# EAGLE design power (EAGLE 7.5.0)
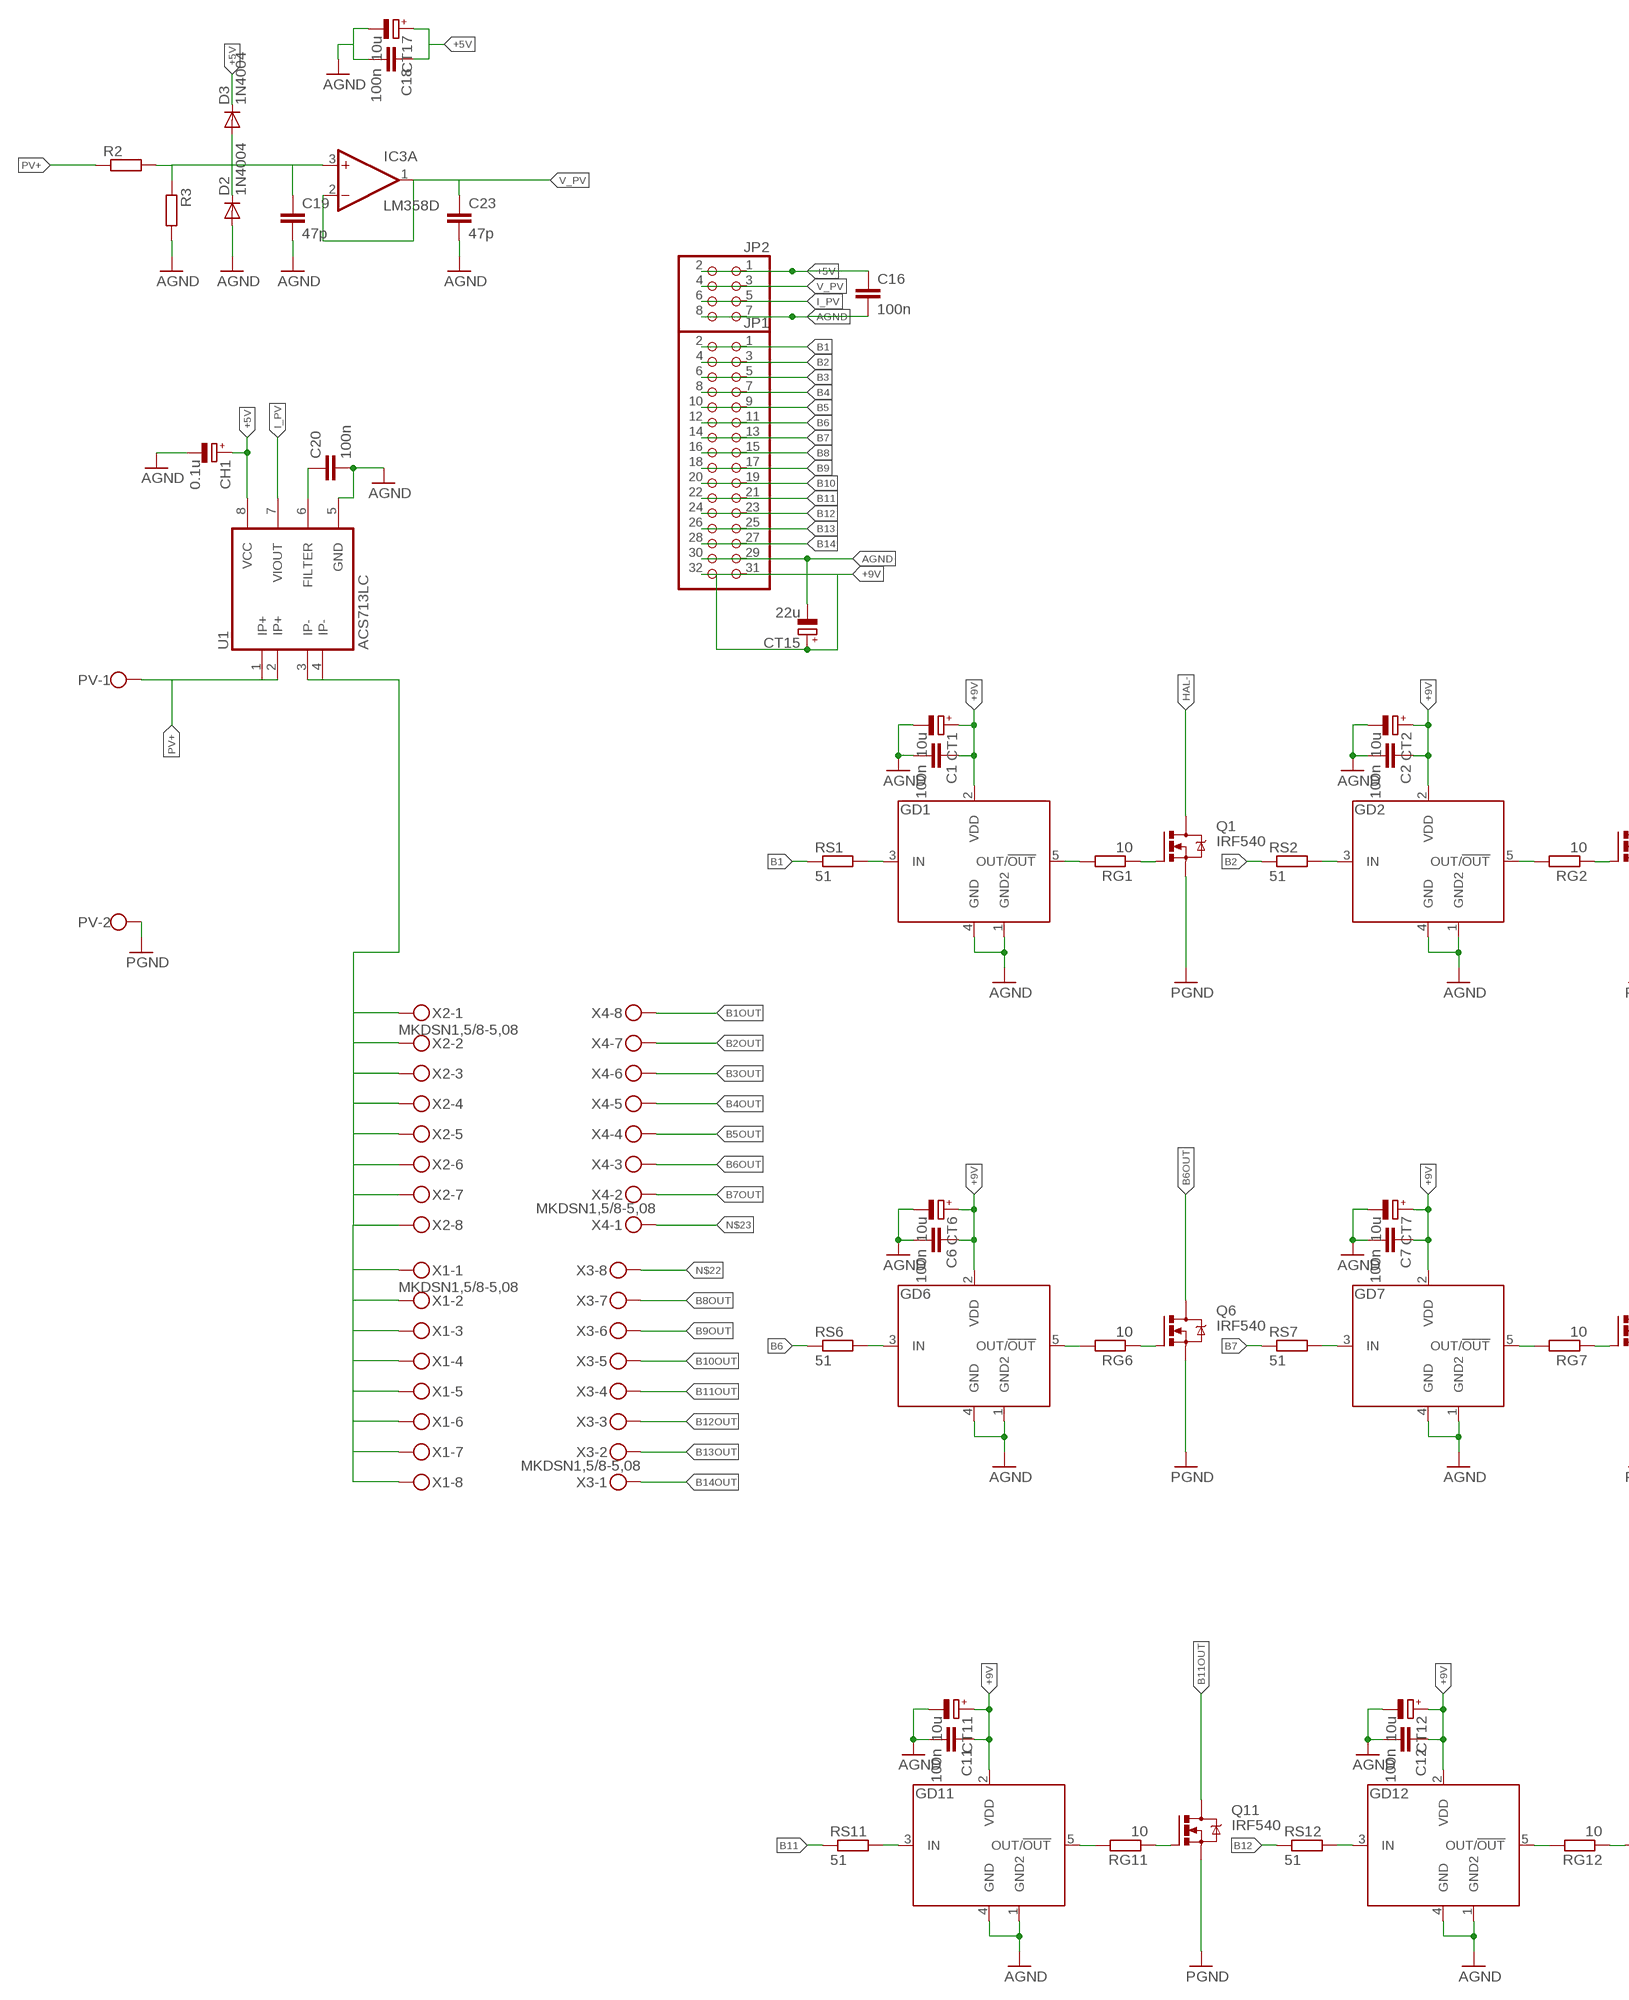
[diagram p0: schematic, sheet 1, part 1 of 2]
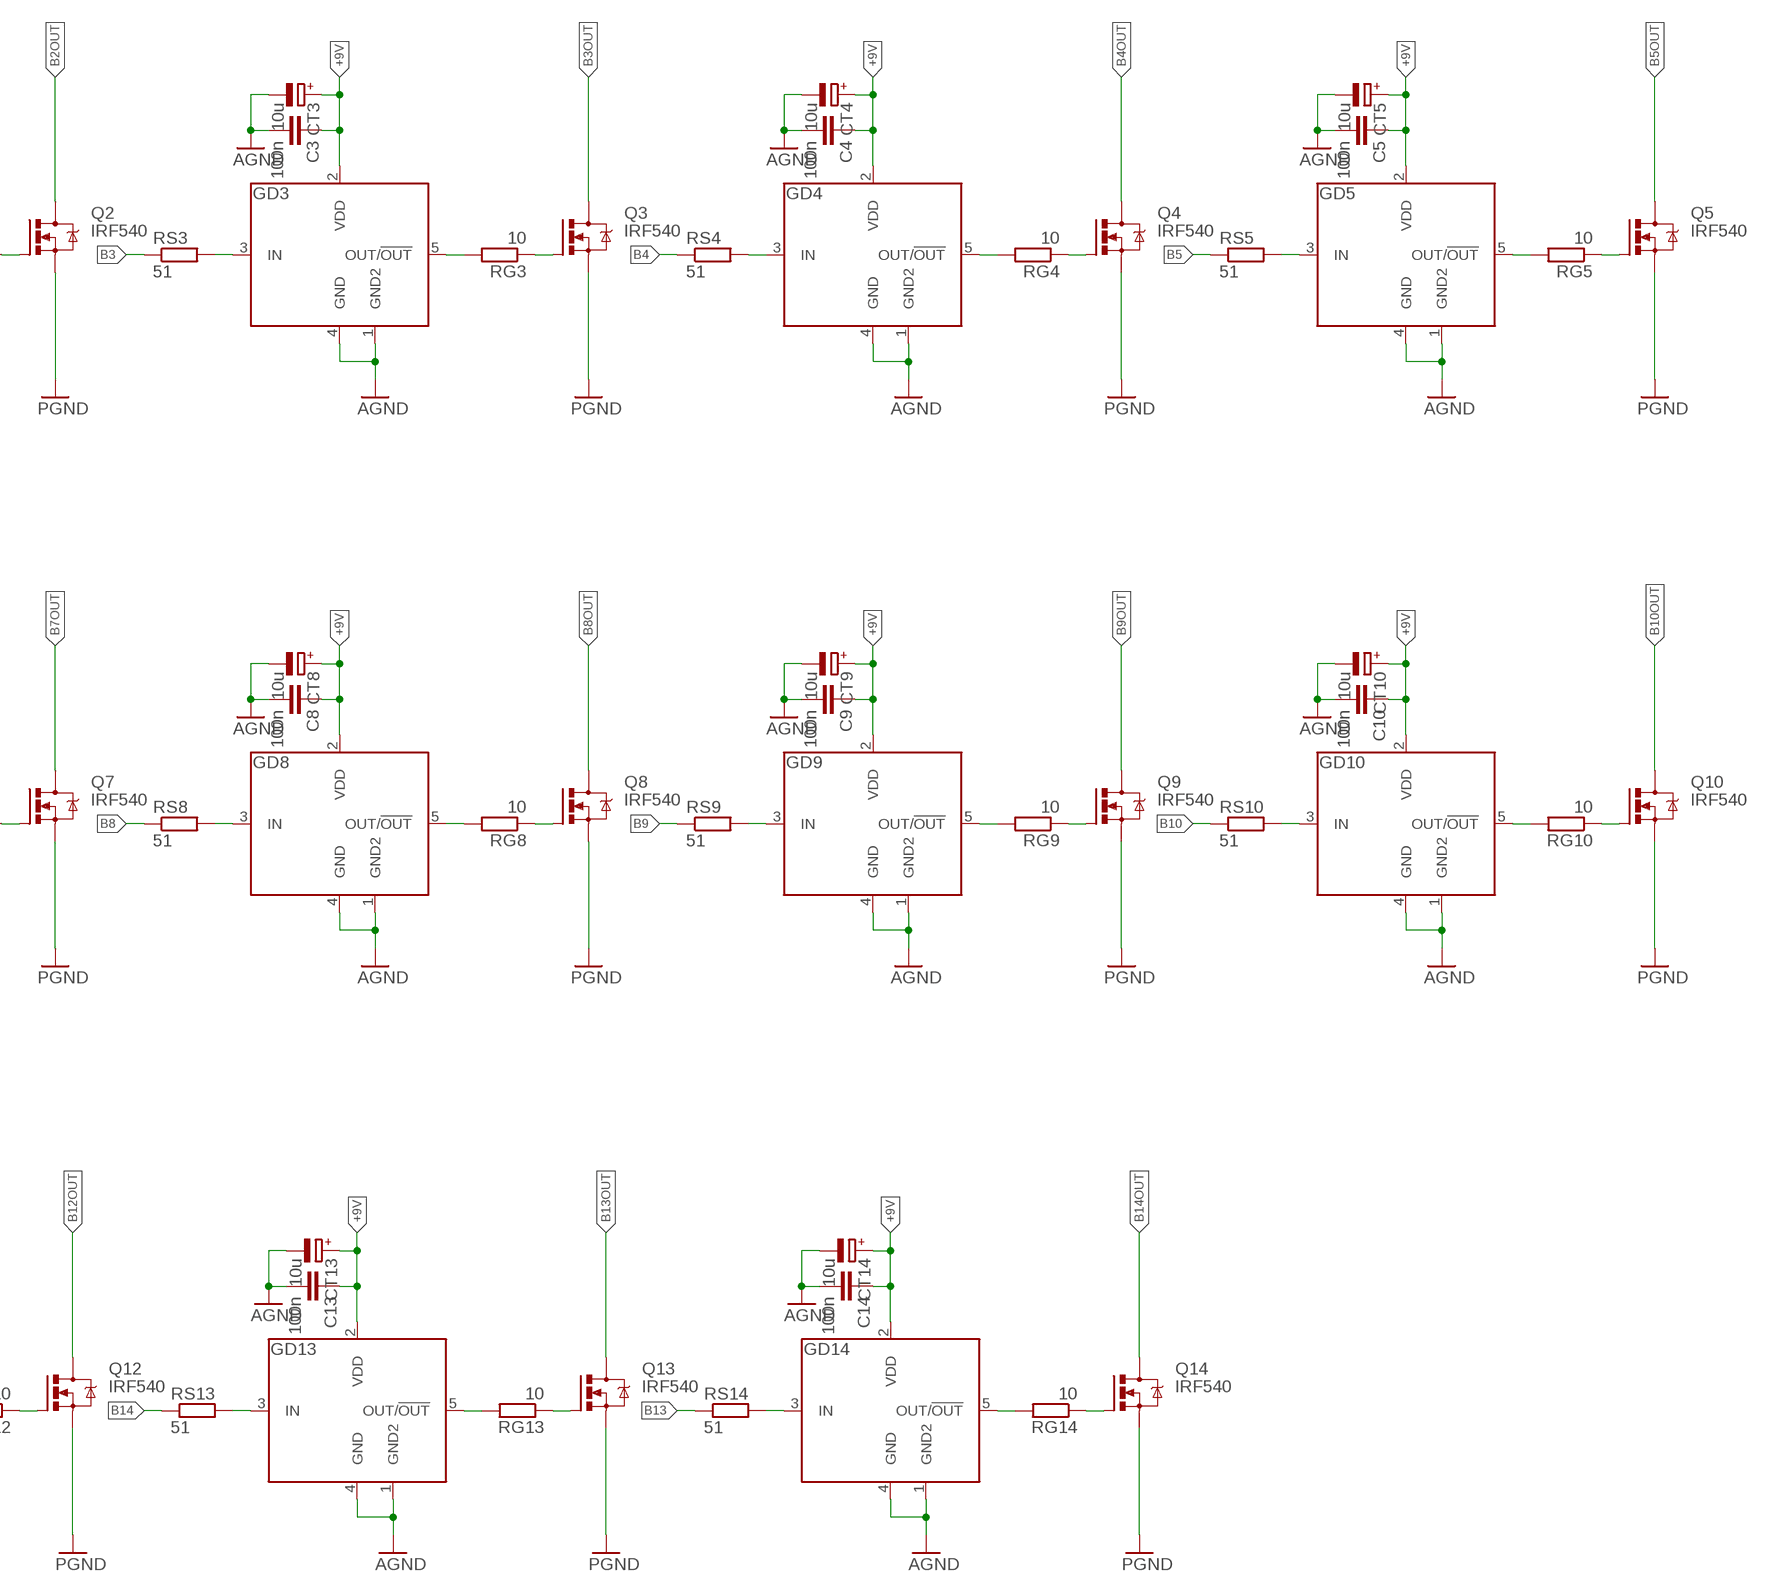
[diagram p1: schematic, sheet 1, part 2 of 2]

## Parts
C1  100n  C-EUC0603  [C0603]
C2  100n  C-EUC0603  [C0603]
C3  100n  C-EUC0603  [C0603]
C4  100n  C-EUC0603  [C0603]
C5  100n  C-EUC0603  [C0603]
C6  100n  C-EUC0603  [C0603]
C7  100n  C-EUC0603  [C0603]
C8  100n  C-EUC0603  [C0603]
C9  100n  C-EUC0603  [C0603]
C10  100n  C-EUC0603  [C0603]
C11  100n  C-EUC0603  [C0603]
C12  100n  C-EUC0603  [C0603]
C13  100n  C-EUC0603  [C0603]
C14  100n  C-EUC0603  [C0603]
C16  100n  C-EUC0603  [C0603]
C18  100n  C-EUC0603  [C0603]
C19  47p  C-EUC0603  [C0603]
C20  100n  C-EUC0603  [C0603]
C23  47p  C-EUC0603  [C0603]
CH1  0.1u  CPOL-EUB/3528-21W  [B/3528-21W]
CT1  10u  CPOL-EUB/3528-21W  [B/3528-21W]
CT2  10u  CPOL-EUB/3528-21W  [B/3528-21W]
CT3  10u  CPOL-EUB/3528-21W  [B/3528-21W]
CT4  10u  CPOL-EUB/3528-21W  [B/3528-21W]
CT5  10u  CPOL-EUB/3528-21W  [B/3528-21W]
CT6  10u  CPOL-EUB/3528-21W  [B/3528-21W]
CT7  10u  CPOL-EUB/3528-21W  [B/3528-21W]
CT8  10u  CPOL-EUB/3528-21W  [B/3528-21W]
CT9  10u  CPOL-EUB/3528-21W  [B/3528-21W]
CT10  10u  CPOL-EUB/3528-21W  [B/3528-21W]
CT11  10u  CPOL-EUB/3528-21W  [B/3528-21W]
CT12  10u  CPOL-EUB/3528-21W  [B/3528-21W]
CT13  10u  CPOL-EUB/3528-21W  [B/3528-21W]
CT14  10u  CPOL-EUB/3528-21W  [B/3528-21W]
CT15  22u  CPOL-EUB/3528-21W  [B/3528-21W]
CT17  10u  CPOL-EUB/3528-21W  [B/3528-21W]
D2  1N4004  [DO214AC]
D3  1N4004  [DO214AC]
GD1  MCP1415/16  [SOT23-5L]
GD2  MCP1415/16  [SOT23-5L]
GD3  MCP1415/16  [SOT23-5L]
GD4  MCP1415/16  [SOT23-5L]
GD5  MCP1415/16  [SOT23-5L]
GD6  MCP1415/16  [SOT23-5L]
GD7  MCP1415/16  [SOT23-5L]
GD8  MCP1415/16  [SOT23-5L]
GD9  MCP1415/16  [SOT23-5L]
GD10  MCP1415/16  [SOT23-5L]
GD11  MCP1415/16  [SOT23-5L]
GD12  MCP1415/16  [SOT23-5L]
GD13  MCP1415/16  [SOT23-5L]
GD14  MCP1415/16  [SOT23-5L]
IC3  LM358D  [SO08]
JP1  PINHD-2X16  [2X16]
JP2  PINHD-2X4  [2X04]
PV  W237-102  [W237-102]
Q1  IRF540  [TO220BV]
Q2  IRF540  [TO220BV]
Q3  IRF540  [TO220BV]
Q4  IRF540  [TO220BV]
Q5  IRF540  [TO220BV]
Q6  IRF540  [TO220BV]
Q7  IRF540  [TO220BV]
Q8  IRF540  [TO220BV]
Q9  IRF540  [TO220BV]
Q10  IRF540  [TO220BV]
Q11  IRF540  [TO220BV]
Q12  IRF540  [TO220BV]
Q13  IRF540  [TO220BV]
Q14  IRF540  [TO220BV]
R2  R-EU_R1206  [R1206]
R3  R-EU_R1206  [R1206]
RG1  10  R-EU_R1206  [R1206]
RG2  10  R-EU_R1206  [R1206]
RG3  10  R-EU_R1206  [R1206]
RG4  10  R-EU_R1206  [R1206]
RG5  10  R-EU_R1206  [R1206]
RG6  10  R-EU_R1206  [R1206]
RG7  10  R-EU_R1206  [R1206]
RG8  10  R-EU_R1206  [R1206]
RG9  10  R-EU_R1206  [R1206]
RG10  10  R-EU_R1206  [R1206]
RG11  10  R-EU_R1206  [R1206]
RG12  10  R-EU_R1206  [R1206]
RG13  10  R-EU_R1206  [R1206]
RG14  10  R-EU_R1206  [R1206]
RS1  51  R-EU_R1206  [R1206]
RS2  51  R-EU_R1206  [R1206]
RS3  51  R-EU_R1206  [R1206]
RS4  51  R-EU_R1206  [R1206]
RS5  51  R-EU_R1206  [R1206]
RS6  51  R-EU_R1206  [R1206]
RS7  51  R-EU_R1206  [R1206]
RS8  51  R-EU_R1206  [R1206]
RS9  51  R-EU_R1206  [R1206]
RS10  51  R-EU_R1206  [R1206]
RS11  51  R-EU_R1206  [R1206]
RS12  51  R-EU_R1206  [R1206]
RS13  51  R-EU_R1206  [R1206]
RS14  51  R-EU_R1206  [R1206]
U1  ACS713LC  [SO08]
X1  MKDSN1,5/8-5,08  [MKDSN1,5/8-5,08]
X2  MKDSN1,5/8-5,08  [MKDSN1,5/8-5,08]
X3  MKDSN1,5/8-5,08  [MKDSN1,5/8-5,08]
X4  MKDSN1,5/8-5,08  [MKDSN1,5/8-5,08]

## Nets
21: GD12.3(IN) RS12.2
4524: GD10.3(IN) RS10.2
24504: GD5.3(IN) RS5.2
27872: GD13.3(IN) RS13.2
85245: GD3.3(IN) RS3.2
125204: GD7.3(IN) RS7.2
152210: GD9.3(IN) RS9.2
245242: GD11.3(IN) RS11.2
254245: GD4.3(IN) RS4.2
+5V: C16.1 C18.1 CH1.+ CT17.+ D3.C JP2.1 JP2.2 U1.8(VCC)
+9V: C1.1 C2.1 C3.1 C4.1 C5.1 C6.1 C7.1 C8.1 C9.1 C10.1 C11.1 C12.1 C13.1 C14.1 CT1.+ CT2.+ CT3.+ CT4.+ CT5.+ CT6.+ CT7.+ CT8.+ CT9.+ CT10.+ CT11.+ CT12.+ CT13.+ CT14.+ CT15.+ GD1.2(VDD) GD2.2(VDD) GD3.2(VDD) GD4.2(VDD) GD5.2(VDD) GD6.2(VDD) GD7.2(VDD) GD8.2(VDD) GD9.2(VDD) GD10.2(VDD) GD11.2(VDD) GD12.2(VDD) GD13.2(VDD) GD14.2(VDD) JP1.31 JP1.32
AGND: C1.2 C2.2 C3.2 C4.2 C5.2 C6.2 C7.2 C8.2 C9.2 C10.2 C11.2 C12.2 C13.2 C14.2 C16.2 C18.2 C19.2 C20.2 C23.2 CH1.- CT1.- CT2.- CT3.- CT4.- CT5.- CT6.- CT7.- CT8.- CT9.- CT10.- CT11.- CT12.- CT13.- CT14.- CT15.- CT17.- D2.A GD1.1(GND2) GD1.4(GND) GD2.1(GND2) GD2.4(GND) GD3.1(GND2) GD3.4(GND) GD4.1(GND2) GD4.4(GND) GD5.1(GND2) GD5.4(GND) GD6.1(GND2) GD6.4(GND) GD7.1(GND2) GD7.4(GND) GD8.1(GND2) GD8.4(GND) GD9.1(GND2) GD9.4(GND) GD10.1(GND2) GD10.4(GND) GD11.1(GND2) GD11.4(GND) GD12.1(GND2) GD12.4(GND) GD13.1(GND2) GD13.4(GND) GD14.1(GND2) GD14.4(GND) JP1.29 JP1.30 JP2.7 JP2.8 R3.2 U1.5(GND)
B1: JP1.1 JP1.2 RS1.1
B1OUT: X4.8
B2: JP1.3 JP1.4 RS2.1
B2OUT: Q2.D X4.7
B3: JP1.5 JP1.6 RS3.1
B3OUT: Q3.D X4.6
B4: JP1.7 JP1.8 RS4.1
B4OUT: Q4.D X4.5
B5: JP1.9 JP1.10 RS5.1
B5OUT: Q5.D X4.4
B6: JP1.11 JP1.12 RS6.1
B6OUT: Q6.D X4.3
B7: JP1.13 JP1.14 RS7.1
B7OUT: Q7.D X4.2
B8: JP1.15 JP1.16 RS8.1
B8OUT: Q8.D X3.7
B9: JP1.17 JP1.18 RS9.1
B9OUT: Q9.D X3.6
B10: JP1.19 JP1.20 RS10.1
B10OUT: Q10.D X3.5
B11: JP1.21 JP1.22 RS11.1
B11OUT: Q11.D X3.4
B12: JP1.23 JP1.24 RS12.1
B12OUT: Q12.D X3.3
B13: JP1.25 JP1.26 RS14.1
B13OUT: Q13.D X3.2
B14: JP1.27 JP1.28 RS13.1
B14OUT: Q14.D X3.1
DVFEWV: GD1.3(IN) RS1.2
HAL-: Q1.D U1.3(IP-) U1.4(IP-) X1.1 X1.2 X1.3 X1.4 X1.5 X1.6 X1.7 X1.8 X2.1 X2.2 X2.3 X2.4 X2.5 X2.6 X2.7 X2.8
I_PV: JP2.5 JP2.6 U1.7(VIOUT)
N$1: GD2.5(OUT/!OUT) RG2.2
N$2: Q1.G RG1.1
N$3: GD1.5(OUT/!OUT) RG1.2
N$4: Q2.G RG2.1
N$5: GD3.5(OUT/!OUT) RG3.2
N$6: Q3.G RG3.1
N$7: GD4.5(OUT/!OUT) RG4.2
N$8: Q4.G RG4.1
N$9: GD5.5(OUT/!OUT) RG5.2
N$10: Q5.G RG5.1
N$11: GD10.5(OUT/!OUT) RG10.2
N$12: Q10.G RG10.1
N$13: GD9.5(OUT/!OUT) RG9.2
N$14: Q9.G RG9.1
N$15: GD8.5(OUT/!OUT) RG8.2
N$16: Q8.G RG8.1
N$17: GD7.5(OUT/!OUT) RG7.2
N$18: Q7.G RG7.1
N$19: GD6.5(OUT/!OUT) RG6.2
N$20: Q6.G RG6.1
N$22: X3.8
N$23: X4.1
N$24: GD11.5(OUT/!OUT) RG11.2
N$25: Q11.G RG11.1
N$26: GD12.5(OUT/!OUT) RG12.2
N$27: Q12.G RG12.1
N$28: GD13.5(OUT/!OUT) RG13.2
N$29: Q13.G RG13.1
N$30: GD14.5(OUT/!OUT) RG14.2
N$31: Q14.G RG14.1
N$33: C19.1 D2.C D3.A IC3.3(A:+IN) R2.2 R3.1
N$34: C20.1 U1.6(FILTER)
N$35: GD2.3(IN) RS2.2
N$45: GD8.3(IN) RS8.2
N$47: GD6.3(IN) RS6.2
N$51: GD14.3(IN) RS14.2
PGND: PV.2 Q1.S Q2.S Q3.S Q4.S Q5.S Q6.S Q7.S Q8.S Q9.S Q10.S Q11.S Q12.S Q13.S Q14.S
PV+: PV.1 R2.1 U1.1(IP+) U1.2(IP+)
V_PV: C23.1 IC3.1(A:OUT) IC3.2(A:-IN) JP2.3 JP2.4
Unconnected: IC3.5(B:+IN) IC3.6(B:-IN) IC3.7(B:OUT)

## Power pins joined to a net without a drawn wire
+5V: IC3.8(P:V+)
AGND: IC3.4(P:V-)

## Library data of the parts
C1-C14 C16 C18-C20 C23 = resistor:C-EU: CAPACITOR, European symbol
CH1 CT1-CT15 CT17 = resistor:CPOL-EU: POLARIZED CAPACITOR, European symbol
D2 D3 = diode:1N4004: DIODE general purpose rectifier, 1 A
GD1-GD14 = microchip2:MCP1415/16: Tiny 1.5A, High-Speed Power MOSFET Driver
IC3 = linear:LM358: OP AMP also LM158; LM258; LM2904 Source: http://cache.national.com/ds/LM/LM158.pdf
JP1 = pinhead:PINHD-2X16: PIN HEADER
JP2 = pinhead:PINHD-2X4: PIN HEADER
PV = con-wago-500:W237-102: WAGO SCREW CLAMP; MPN: 237-102; OC_FARNELL: unknown; OC_NEWARK: 70K9898
Q1-Q14 = transistor-power:IRF540: HEXFET Power MOSFET
R2 R3 RG1-RG14 RS1-RS14 = resistor:R-EU_: RESISTOR, European symbol
U1 = allegro-micro:ACS713: Linear Current Sensor Fully Integrated, Hall Effect-Based 2.1 kVRMS Voltage Isolation and a Low-Resistance Current Conductor
X1-X4 = con-phoenix-508:MKDSN1,5/8-5,08: MKDSN 1,5/ 8-5,08 Printklemme Nennstrom: 13,5 A Nennspannung: 250 V Rastermaß: 5,08 mm Polzahl: 8 Anschlussart: Schraubanschluss Montage: Löten Anschlussrichtung Leiter/Platine: 0 ° Artikelnummer: 1729186 Source: http://eshop.phoenixcontact.com .. 1729186.pdf

## Board
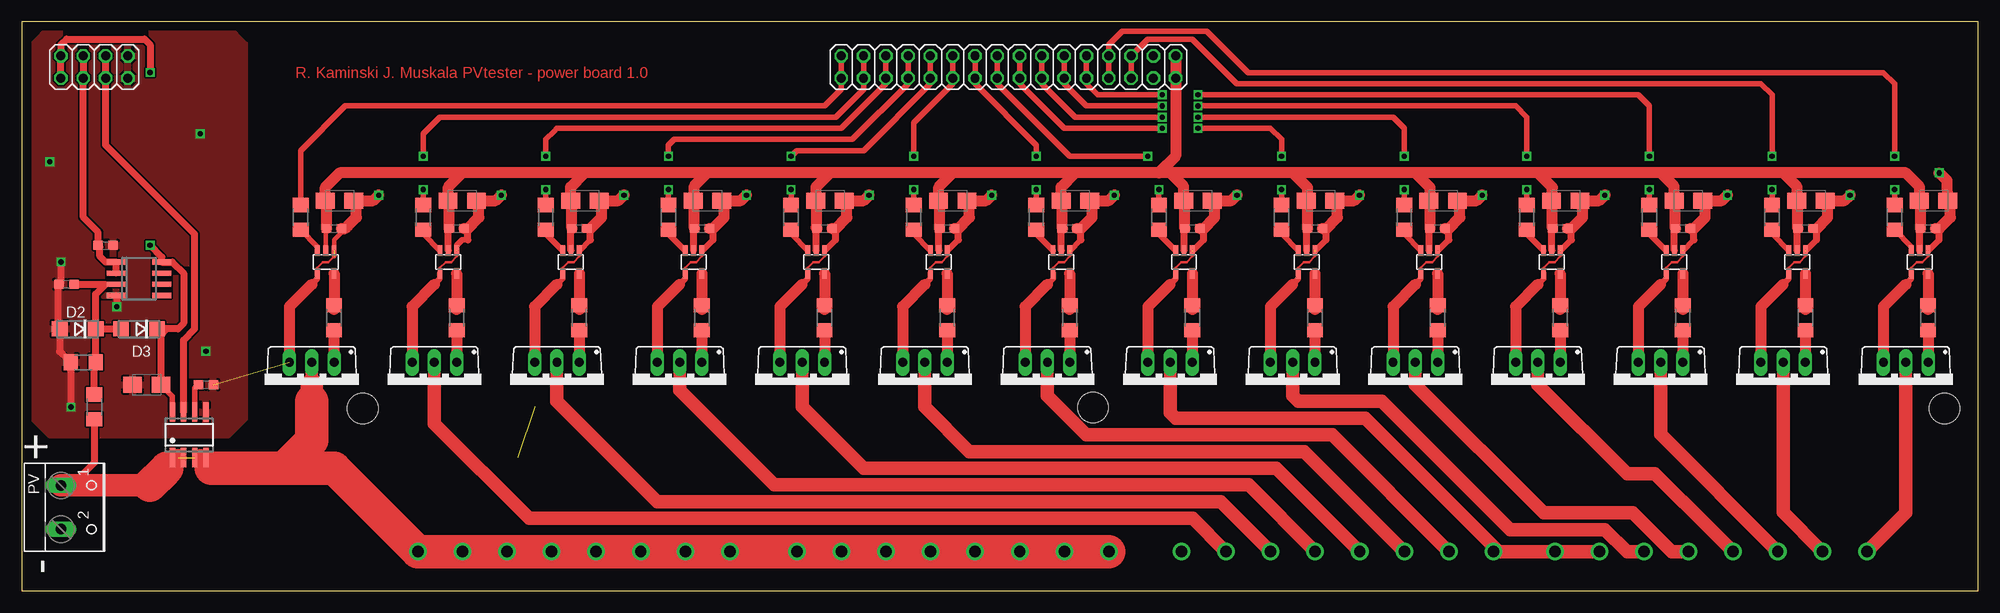
[diagram p2: board, top side]
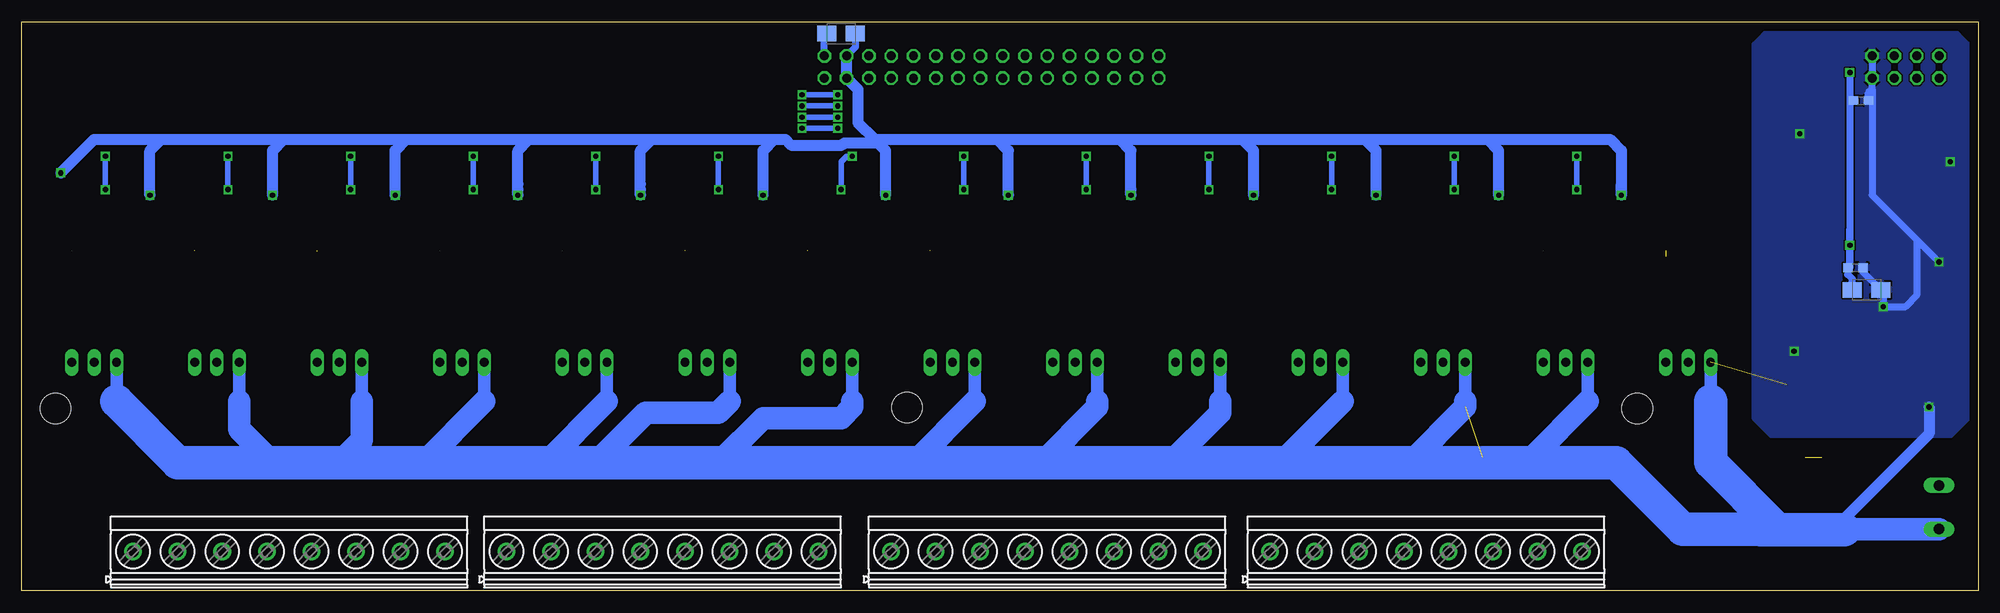
[diagram p3: board, bottom side, seen from below]

Size 222.87 x 64.82 mm. Coordinates in mm from the lower left corner, seen from the top.
Outline: 0,0 222.87,0 222.87,64.82 0,64.82 0,0
Copper layers (1*16): Top 0.035mm / dielectric 1.5mm / Bottom 0.035mm
Design rules "default *": minimum track width 8mil, minimum drill 0.3mm, track to track 8mil, track to pad 8mil, pad to pad 8mil, via to via 8mil, smd to smd 8mil, copper to edge 40mil, drill to drill 8mil, minimum pad ring 10mil, minimum via ring 8mil, stop-mask expansion 4mil, vias tented up to drill 0mil, thermal gap 10mil
Holes 3.5 mm at 219.03,20.8 122.02,20.92 38.83,20.8

### Footprints (pad centres in the part's own frame; a part is rotated, then mirrored left to right if it is on the bottom)
C0603 = smd 1.1 x 1: 1 -0.85,0; 2 0.85,0
B/3528-21W = smd 2.15 x 1.8: + 1.625,0; - -1.625,0
DO214AC = smd 1.8 x 1.7: A 2.05,0; C -2.05,0
SOT23-5L = smd 0.55 x 1.2: 1 -0.95,-1.3; 2 0,-1.3; 3 0.95,-1.3; 4 0.95,1.3; 5 -0.95,1.3
SO08 = smd 0.6 x 2.2: 1 -1.905,-2.6; 2 -0.635,-2.6; 3 0.635,-2.6; 4 1.905,-2.6; 5 1.905,2.6; 6 0.635,2.6; 7 -0.635,2.6; 8 -1.905,2.6
2X16 = drill 1.016 octagon: 1 -19.05,-1.27; 2 -19.05,1.27; 3 -16.51,-1.27; 4 -16.51,1.27; 5 -13.97,-1.27; 6 -13.97,1.27; 7 -11.43,-1.27; 8 -11.43,1.27; 9 -8.89,-1.27; 10 -8.89,1.27; 11 -6.35,-1.27; 12 -6.35,1.27; 13 -3.81,-1.27; 14 -3.81,1.27; 15 -1.27,-1.27; 16 -1.27,1.27; 17 1.27,-1.27; 18 1.27,1.27; 19 3.81,-1.27; 20 3.81,1.27; 21 6.35,-1.27; 22 6.35,1.27; 23 8.89,-1.27; 24 8.89,1.27; 25 11.43,-1.27; 26 11.43,1.27; 27 13.97,-1.27; 28 13.97,1.27; 29 16.51,-1.27; 30 16.51,1.27; 31 19.05,-1.27; 32 19.05,1.27
2X04 = drill 1.016 octagon: 1 -3.81,-1.27; 2 -3.81,1.27; 3 -1.27,-1.27; 4 -1.27,1.27; 5 1.27,-1.27; 6 1.27,1.27; 7 3.81,-1.27; 8 3.81,1.27
W237-102 = drill 1.194 long: 1 -2.5,-1.27; 2 2.5,-1.27
TO220BV = drill 1.016 long: D 0,-2.54; G -2.54,-2.54; S 2.54,-2.54
R1206 = smd 1.6 x 1.803: 1 -1.422,0; 2 1.422,0
MKDSN1,5/8-5,08 = drill 1.3 pad 2: 1 -17.801,0.025; 2 -12.721,0.025; 3 -7.641,0.025; 4 -2.561,0.025; 5 2.519,0.025; 6 7.599,0.025; 7 12.679,0.025; 8 17.759,0.025

### Placement (x,y rotation side)
C1  35.56,41.27 0 top
C2  49.53,41.27 0 top
C3  63.5,41.29 0 top
C4  77.47,41.29 0 top
C5  91.44,41.27 0 top
C6  105.41,41.27 0 top
C7  119.38,41.27 0 top
C8  133.35,41.27 0 top
C9  147.32,41.27 0 top
C10  161.28,41.27 0 top
C11  175.26,41.27 0 top
C12  189.23,41.27 0 top
C13  203.2,41.27 0 top
C14  217.17,41.29 0 top
C16  13.34,55.88 0 bottom
C18  13.97,36.83 0 bottom
C19  5.08,34.92 180 top
C20  20.96,23.5 0 top
C23  9.52,39.37 0 top
CH1  14.22,23.5 0 top
CT1  36.19,44.45 180 top
CT2  50.16,44.45 180 top
CT3  64.13,44.45 180 top
CT4  78.1,44.45 180 top
CT5  92.08,44.45 180 top
CT6  106.05,44.45 180 top
CT7  120.02,44.45 180 top
CT8  133.99,44.45 180 top
CT9  147.96,44.45 180 top
CT10  161.93,44.45 180 top
CT11  175.9,44.45 180 top
CT12  189.87,44.45 180 top
CT13  203.84,44.45 180 top
CT14  217.81,44.45 180 top
CT15  129.54,63.5 180 bottom
CT17  12.7,34.29 180 bottom
D2  6.35,29.85 180 top
D3  13.34,29.85 180 top
GD1  34.61,37.46 180 top
GD2  48.58,37.46 180 top
GD3  62.55,37.46 180 top
GD4  76.52,37.46 180 top
GD5  90.49,37.46 180 top
GD6  104.46,37.46 180 top
GD7  118.43,37.46 180 top
GD8  132.4,37.46 180 top
GD9  146.37,37.46 180 top
GD10  160.34,37.46 180 top
GD11  174.31,37.46 180 top
GD12  188.28,37.46 180 top
GD13  202.25,37.46 180 top
GD14  216.22,37.48 180 top
IC3  13.34,35.56 270 top
JP1  112.39,59.69 0 top
JP2  8.25,59.69 0 top
PV  5.71,9.53 270 top
Q1  33.02,23.5 180 top
Q2  46.99,23.5 180 top
Q3  60.96,23.5 180 top
Q4  74.93,23.5 180 top
Q5  88.9,23.5 180 top
Q6  102.87,23.5 180 top
Q7  116.84,23.5 180 top
Q8  130.81,23.5 180 top
Q9  144.78,23.5 180 top
Q10  158.75,23.5 180 top
Q11  172.72,23.5 180 top
Q12  186.69,23.5 180 top
Q13  200.66,23.5 180 top
Q14  214.63,23.5 180 top
R2  8.25,20.96 90 top
R3  6.98,26.04 180 top
RG1  35.56,31.11 90 top
RG2  49.53,31.11 90 top
RG3  63.5,31.11 90 top
RG4  77.47,31.11 90 top
RG5  91.44,31.11 90 top
RG6  105.41,31.11 90 top
RG7  119.38,31.11 90 top
RG8  133.35,31.11 90 top
RG9  147.32,31.11 90 top
RG10  161.29,31.11 90 top
RG11  175.26,31.11 90 top
RG12  189.23,31.11 90 top
RG13  203.2,31.11 90 top
RG14  217.17,31.11 90 top
RS1  31.75,42.54 270 top
RS2  45.72,42.54 270 top
RS3  59.69,42.54 270 top
RS4  73.66,42.54 270 top
RS5  87.63,42.54 270 top
RS6  101.6,42.54 270 top
RS7  115.57,42.54 270 top
RS8  129.54,42.54 270 top
RS9  143.51,42.54 270 top
RS10  157.48,42.54 270 top
RS11  171.45,42.54 270 top
RS12  185.42,42.54 270 top
RS13  199.39,42.54 270 top
RS14  213.36,42.54 270 top
U1  19.05,17.78 0 top
X1  106.05,4.45 0 bottom
X2  62.86,4.45 0 bottom
X3  192.41,4.45 0 bottom
X4  149.86,4.45 0 bottom

### Tracks (layer width: path | path; a pad name or v marks a point on that pad's centre or on a via)
21
  Top 0.61: RS12.2 185.42,40.67 GD12.3
4524
  Top 0.61: RS10.2 157.48,40.67 GD10.3
24504
  Top 0.61: RS5.2 87.63,40.67 GD5.3
27872
  Top 0.305: GD13.3 201.3,38.74 201.3,38.73
  Top 0.61: RS13.2 199.39,40.67 GD13.3
85245
  Top 0.61: RS3.2 59.69,40.67 GD3.3
125204
  Top 0.61: RS7.2 115.57,40.67 GD7.3
152210
  Top 0.305: GD9.3 145.39,38.77
  Top 0.61: RS9.2 143.51,40.67 GD9.3
245242
  Top 0.61: RS11.2 171.45,40.67 GD11.3
254245
  Top 0.61: RS4.2 73.66,40.67 GD4.3
+5V  (via drill 0.6)
  Top 0.61: U1.8 17.14,22.2 CH1.+
  Top 0.813: JP2.1 JP2.2 4.45,62.23 5.08,62.86 13.97,62.86 14.61,62.23 v14.61,59.05 | 16.51,29.85 17.78,29.85 18.42,30.48 18.42,36.2 17.14,37.46 IC3.8 | 16.51,29.85 D3.C 15.24,29.85 | IC3.8 15.93,38.04 v14.61,39.37 | IC3.8 15.88,37.46 | CH1.+ 15.85,29.18 16.51,29.85
  Bottom 0.813: 14.82,34.78 CT17.+ 14.32,35.53 14.86,36.07 14.86,36.79 C18.1 | v14.61,59.05 14.61,55.88 | 14.61,55.88 v14.61,39.37 | v14.61,39.37 14.61,37.04 C18.1 | v14.61,39.37 14.61,41.27 | C18.1 14.61,36.83 v14.61,39.37 | C16.1 14.61,55.88
+9V
  Top 0.508: GD1.2 34.61,41.27
  Top 0.61: GD1.2
  Top 0.813: 34.61,41.27 C1.1 34.61,41.27 | 174.37,41.34 C11.1 174.31,41.27 GD11.2 | GD2.2 48.58,41.27 C2.1 | GD3.2 62.55,41.28 C3.1 | GD4.2 76.52,41.28 C4.1 | GD5.2 90.49,41.27 C5.1 | GD6.2 104.46,41.27 C6.1 | GD7.2 118.43,41.27 C7.1 | GD8.2 132.4,41.27 C8.1 | GD9.2 146.37,41.27 C9.1 | GD10.2 160.34,41.27 C10.1 | GD12.2 188.28,41.27 C12.1 | GD13.2 202.25,41.27 C13.1 | GD14.2 216.22,41.28 C14.1
  Top 1.27: 34.61,44.39 CT1.+ | 62.55,44.39 CT3.+ | 76.52,44.39 CT4.+ 76.62,44.31 | 90.49,44.39 CT5.+ | 118.43,44.39 CT7.+ | 132.4,44.39 CT8.+ | 146.37,44.39 CT9.+ 146.47,44.31 | 160.33,44.38 CT10.+ 160.43,44.32 | 188.28,44.39 CT12.+ | CT14.+ 216.22,44.39 216.22,45.09 | 129.54,47.62 131.45,49.53 JP1.31 JP1.32 | 129.54,47.62 120.02,47.62 | 120.02,47.62 106.05,47.62 | 106.05,47.62 92.08,47.62 | 92.08,47.62 78.1,47.62 | 78.1,47.62 64.13,47.62 | 64.13,47.62 50.16,47.62 | 50.16,47.62 36.19,47.62 34.57,46 CT1.+ | 50.16,47.62 48.58,46.04 48.58,44.39 CT2.+ 48.68,44.31 C2.1 | 90.49,44.39 90.49,46.04 92.08,47.62 | 106.05,47.62 104.46,46.04 104.46,44.39 CT6.+ 104.56,44.31 C6.1 | 200.66,47.62 214.63,47.62 216.22,46.03 216.22,45.09 | 200.66,47.62 186.69,47.62 | 186.69,47.62 172.72,47.62 | 172.72,47.62 158.75,47.62 | 158.75,47.62 144.78,47.62 | 144.78,47.62 130.81,47.62 | 130.81,47.62 129.54,47.62 | C14.1 216.32,44.98 216.22,45.09 | C13.1 202.35,44.31 CT13.+ 202.25,44.39 202.25,46.03 200.66,47.62 | C12.1 188.38,44.31 CT12.+ | 174.37,41.34 174.37,44.35 | 174.37,44.35 CT11.+ | C1.1 34.71,44.31 CT1.+ | CT12.+ 188.24,46.07 186.69,47.62 | 174.37,44.35 174.37,45.97 172.72,47.62 | C10.1 160.43,44.32 | 160.43,44.32 160.43,45.95 158.75,47.62 | C9.1 146.47,44.31 | 146.47,44.31 146.47,45.93 144.78,47.62 | C8.1 132.5,44.31 CT8.+ | CT8.+ 132.36,46.07 130.81,47.62 | CT7.+ 118.39,46 120.02,47.62 | C7.1 118.53,44.31 CT7.+ | 90.49,44.39 90.49,41.38 C5.1 | C4.1 76.62,44.31 | 76.62,44.31 76.62,46.14 78.1,47.62 | C3.1 62.65,44.31 CT3.+ | CT3.+ 62.51,46 64.13,47.62
  Bottom 0.813: 131.03,63.28 130.81,63.5 CT15.+ 131.45,63.22 JP1.32
AGND  (via drill 0.6)  (11 unrouted)
  Top 0.305: GD1.4 33.66,36.83 34.29,37.46 34.92,37.46 35.56,38.1 | GD2.4 47.63,36.83 48.26,37.46 48.89,37.46 49.53,38.1 GD2.1 | GD3.4 61.6,36.83 62.23,37.46 62.86,37.46 63.5,38.1 GD3.1 | GD4.4 75.57,36.83 76.2,37.46 76.83,37.46 77.47,38.1 GD4.1 | GD5.4 89.54,36.83 90.17,37.46 90.8,37.46 91.44,38.1 GD5.1 | GD6.4 103.51,36.83 104.14,37.46 104.77,37.46 105.41,38.1 GD6.1 | GD7.4 117.48,36.83 118.11,37.46 118.74,37.46 119.38,38.1 GD7.1 | GD8.4 131.45,36.83 132.08,37.46 132.72,37.46 133.35,38.1 GD8.1 | GD9.4 145.42,36.83 146.05,37.46 146.69,37.46 147.32,38.1 GD9.1 | GD10.4 159.39,36.83 160.02,37.46 160.66,37.46 161.29,38.1 GD10.1 | GD11.4 173.36,36.83 173.99,37.46 174.62,37.46 175.26,38.1 GD11.1 | GD12.4 187.33,36.83 187.96,37.46 188.59,37.46 189.23,38.1 GD12.1 | GD13.4 201.3,36.83 201.93,37.46 202.56,37.46 203.2,38.1 GD13.1 | GD14.4 215.27,36.83 215.9,37.46 216.53,37.46 217.17,38.1 GD14.1
  Top 0.508: 35.56,38.1 35.56,40 37.15,41.59
  Top 0.61: 50.8,40 50.16,40 49.53,39.37 GD2.1 | 217.21,38.78 218.44,40 | 203.23,38.77 204.47,40 | 189.26,38.77 190.5,40 | 175.29,38.77 176.53,40 | 161.32,38.77 162.56,40 | 147.35,38.77 148.59,40 | 133.38,38.77 134.62,40 | 119.41,38.77 120.65,40 | GD6.1 105.44,38.77 106.68,40 | GD5.1 91.47,38.77 92.71,40 | GD4.1 77.5,38.77 78.74,40 | GD3.1 63.53,38.77 64.77,40 | GD14.4 215.27,35.56 214.63,34.92 | GD13.4 201.3,35.56 200.66,34.92 | GD12.4 187.33,35.56 186.69,34.92 | GD11.4 173.36,35.56 172.72,34.92 | GD10.4 159.39,35.56 158.75,34.92 | GD9.4 145.42,35.56 144.78,34.92 | GD8.4 131.45,35.56 130.81,34.92 | GD7.4 117.48,35.56 116.84,34.92 | GD6.4 103.51,35.56 102.87,34.92 | GD5.4 89.54,35.56 88.9,34.92 | GD4.4 75.57,35.56 74.93,34.92 | GD3.4 61.6,35.56 60.96,34.92 | GD2.4 47.63,35.56 46.99,34.92 | GD1.4 33.66,35.56 33.02,34.92
  Top 0.813: 4.45,35.24 C19.2 | 92.71,40 92.71,40.95 C5.2 | 78.74,40 78.74,40.97 C4.2 | 64.77,40 64.77,41.27 64.46,41.27 C3.2 | 50.8,40 50.8,40.95 C2.2 | 106.68,40 106.68,40.95 C6.2 | 120.65,40 120.65,40.95 C7.2 | 134.62,40 134.62,40.95 C8.2 | 148.59,40 148.59,40.95 C9.2 | 162.56,40 162.56,40.94 C10.2 | 176.53,40 176.53,40.95 C11.2 | 190.5,40 190.5,40.95 C12.2 | 204.47,40 204.47,41.27 C13.2 | 218.44,40 218.44,40.97 C14.2 | C19.2 4.13,34.82 4.13,30.02 D2.A 4.3,27.3 R3.2 5.56,20.98 v5.59,20.96 | v4.45,37.46 4.45,35.14 C19.2 | IC3.4 10.73,33.59 10.79,33.59 v10.79,32.38
  Top 1.27: v124.46,45.09 123.83,44.45 CT7.- 121.92,44.17 121.92,42.54 120.65,41.27 C7.2 | v110.49,45.09 109.85,44.45 CT6.- 107.95,44.17 107.95,42.54 106.68,41.27 C6.2 | v96.52,45.09 95.88,44.45 CT5.- 93.98,44.17 93.98,42.54 92.71,41.27 C5.2 | v82.55,45.09 81.91,44.45 CT4.- 80.01,44.17 80.01,42.54 78.75,41.29 C4.2 | v68.58,45.09 67.94,44.45 CT3.- 66.04,44.17 66.04,42.54 64.77,41.27 | v54.61,45.09 53.97,44.45 CT2.- 52.07,44.17 52.07,42.54 50.8,41.27 C2.2 | v40.64,45.09 40,44.45 CT1.- 38.1,44.17 38.1,42.54 37.15,41.59 36.83,41.27 C1.2 | v138.43,45.09 137.8,44.45 CT8.- 135.89,44.17 135.89,42.54 134.62,41.27 C8.2 | v152.4,45.09 151.77,44.45 CT9.- 149.86,44.17 149.86,42.54 148.59,41.27 C9.2 | v166.37,45.09 165.74,44.45 CT10.- 163.83,44.17 163.83,42.54 162.56,41.27 C10.2 | v180.34,45.09 179.71,44.45 CT11.- 177.8,44.17 177.8,42.54 176.53,41.27 C11.2 | v194.31,45.09 193.68,44.45 CT12.- 191.77,44.17 191.77,42.54 190.5,41.27 C12.2 | v208.28,45.09 207.65,44.45 CT13.- 205.74,44.17 205.74,42.54 204.47,41.27 | v218.44,47.62 219.33,46.74 CT14.- 219.71,44.17 219.71,42.54 218.45,41.29 C14.2 | 214.63,34.92 212.09,32.38 212.09,26.04 | 200.66,34.92 198.12,32.38 198.12,26.04 | 186.69,34.92 184.15,32.38 184.15,26.04 | 172.72,34.92 170.18,32.38 170.18,26.04 | 158.75,34.92 156.21,32.38 156.21,26.04 | 144.78,34.92 142.24,32.38 142.24,26.04 | 130.81,34.92 128.27,32.38 128.27,26.04 | 116.84,34.92 114.3,32.38 114.3,26.04 | 102.87,34.92 100.33,32.38 100.33,26.04 | 88.9,34.92 86.36,32.38 86.36,26.04 | 74.93,34.92 72.39,32.38 72.39,26.04 | 60.96,34.92 58.42,32.38 58.42,26.04 | 46.99,34.92 44.45,32.38 44.45,26.04
  Top 1.27: 33.02,34.92 30.48,32.38 30.48,26.04
  Bottom 0.813: C18.2 13.12,36.34 CT17.- 11.07,33.93 10.79,33.93 v10.79,32.38 8.25,32.38 6.98,33.66 6.98,40 | v4.45,37.46 6.98,40 | JP2.8 JP2.7 12.07,57.15 | 12.07,57.15 12.07,45.09 6.98,40 | CT15.- 127.92,61.95 JP1.30 | C16.2 12.48,56.73 12.07,57.15
  Bottom 1.27: 96.52,45.72 v96.52,45.09 96.52,50.16 97.79,51.43 | 82.55,45.72 v82.55,45.09 82.55,50.16 83.82,51.43 | v138.43,45.09 138.43,45.72 | v152.4,45.09 152.4,45.72 | v166.37,45.09 166.37,45.72 | v180.34,45.09 180.34,45.72 | JP1.30 JP1.29 127.64,57.15 127.64,53.34 125.73,51.43 | 40.64,46.35 v40.64,45.09 40.64,50.16 41.91,51.43 55.88,51.43 | v138.43,45.09 138.43,46.35 | v152.4,45.09 152.4,46.35 | v166.37,45.09 166.37,46.35 | v180.34,45.09 180.34,46.35 | 194.31,46.35 v194.31,45.09 194.31,50.16 193.04,51.43 | 125.73,51.43 125.09,51.43 | 125.09,51.43 111.76,51.43 | 111.76,51.43 97.79,51.43 | 97.79,51.43 83.82,51.43 | 83.82,51.43 69.85,51.43 | 69.85,51.43 55.88,51.43 | v54.61,45.09 54.61,50.16 55.88,51.43 | v68.58,45.09 68.58,50.16 69.85,51.43 | v110.49,45.09 110.49,50.16 111.76,51.43 | v124.46,45.09 124.46,50.16 125.73,51.43 | v138.43,45.09 138.43,50.16 137.16,51.43 | v152.4,45.09 152.4,50.16 151.13,51.43 | 151.13,51.43 137.16,51.43 | v166.37,45.09 166.37,50.16 165.1,51.43 | 165.1,51.43 151.13,51.43 | v180.34,45.09 180.34,50.16 179.07,51.43 | 179.07,51.43 165.1,51.43 | 193.04,51.43 179.07,51.43 | v208.28,45.09 208.28,50.16 207.01,51.43 | 207.01,51.43 193.04,51.43 | v218.44,47.62 214.63,51.43 207.01,51.43 | 137.16,51.43 135.89,51.43 135.26,50.8 129.41,50.8 129.16,51.05 125.48,51.05 125.09,51.43 | v5.59,20.96 5.59,17.91 16.51,6.98
  other vias: 3.18,48.89 20.32,52.07 20.96,27.3
  pour Bottom: 1.27,62.23 1.27,19.69 3.18,17.78 23.5,17.78 25.4,19.69 25.4,62.23 23.5,64.13 3.18,64.13
  pour Top: 1.27,62.23 1.27,19.69 3.18,17.78 23.5,17.78 25.4,19.69 25.4,62.23 23.5,64.13 3.18,64.13
B1
  Top 0.61: JP1.2 JP1.1 93.34,57.15 91.44,55.24 36.83,55.24 31.75,50.16 RS1.1
B2  (via drill 0.6)
  Top 0.61: v45.72,49.53 45.72,52.07 47.62,53.97 92.71,53.97 95.88,57.15 JP1.3 JP1.4 | RS2.1 v45.72,45.72
  Bottom 0.61: v45.72,45.72 v45.72,49.53
B2OUT
  Top 1.422: Q2.D 46.99,23.5
  Top 1.524: 46.99,23.5 46.99,19.05 57.78,8.25 133.4,8.25 X4.7
B3  (via drill 0.6)
  Top 0.61: v59.69,49.53 59.69,51.43 60.64,52.39 60.96,52.7 93.34,52.7 98.42,57.78 JP1.5 JP1.6 | RS3.1 v59.69,45.72
  Bottom 0.61: v59.69,49.53 v59.69,45.72
B3OUT
  Top 1.422: Q3.D 60.96,23.5
  Top 1.524: 60.96,23.5 60.96,21.59 72.39,10.16 136.57,10.16 X4.6
B4  (via drill 0.6)
  Top 0.61: v73.66,49.53 73.66,50.8 74.3,51.43 94.61,51.43 100.96,57.78 JP1.7 JP1.8 | RS4.1 v73.66,45.72
  Bottom 0.61: v73.66,49.53 v73.66,45.72
B4OUT
  Top 1.422: Q4.D 74.93,23.5
  Top 1.524: 74.93,23.5 74.93,22.86 85.72,12.06 139.75,12.06 X4.5
B5  (via drill 0.6)
  Top 0.61: JP1.10 JP1.9 103.5,57.78 95.88,50.16 88.27,50.16 v87.63,49.53 | RS5.1 v87.63,45.72
  Bottom 0.61: v87.63,49.53 v87.63,45.72
B5OUT
  Top 1.422: Q5.D 88.9,23.5
  Top 1.524: 88.9,23.5 88.9,20.96 95.88,13.97 142.92,13.97 X4.4
B6  (via drill 0.6)
  Top 0.61: v101.6,49.53 101.6,53.34 106.05,57.78 JP1.11 JP1.12 | RS6.1 v101.6,45.72
  Bottom 0.61: v101.6,49.53 v101.6,45.72
B6OUT
  Top 1.422: Q6.D 102.87,23.5
  Top 1.524: 102.87,23.5 102.87,20.96 107.95,15.87 146.1,15.87 X4.3
B7  (via drill 0.6)
  Top 0.61: v115.57,49.53 115.57,50.8 108.58,57.78 JP1.13 JP1.14 | RS7.1 v115.57,45.72
  Bottom 0.61: v115.57,49.53 v115.57,45.72
B7OUT
  Top 1.422: Q7.D 116.84,23.5
  Top 1.524: 116.84,23.5 116.84,22.23 121.28,17.78 149.27,17.78 X4.2
B8  (via drill 0.6)
  Top 0.61: v128.27,49.53 119.38,49.53 111.12,57.78 JP1.15 JP1.16 | RS8.1 v129.54,45.72
  Bottom 0.61: v129.54,45.72 129.54,48.89 128.91,49.53 v128.27,49.53
B8OUT
  Top 1.422: Q8.D 130.81,23.5
  Top 1.524: 130.81,23.5 130.81,20.32 131.45,19.69 153.03,19.69 168.28,4.45 179.7,4.45 X3.7
B9  (via drill 0.6)
  Top 0.61: v129.92,52.7 118.74,52.7 113.67,57.78 JP1.17 JP1.18 | v143.51,49.53 143.51,51.43 142.24,52.7 v133.99,52.7 | RS9.1 v143.51,45.72
  Bottom 0.61: v129.92,52.7 v133.99,52.7 | v143.51,45.72 v143.51,49.53
B9OUT
  Top 1.422: Q9.D 144.78,23.5
  Top 1.524: 144.78,23.5 144.78,22.23 145.42,21.59 154.94,21.59 169.55,6.98 180.34,6.98 182.88,4.45 184.78,4.45 X3.6
B10  (via drill 0.6)
  Top 0.61: v129.92,53.97 120.02,53.97 116.2,57.78 JP1.19 JP1.20 | v133.99,53.97 156.21,53.97 157.48,52.7 v157.48,49.53 | v157.48,45.72 RS10.1
  Bottom 0.61: v129.92,53.97 v133.99,53.97 | v157.48,49.53 v157.48,45.72
B10OUT
  Top 1.422: Q10.D 158.75,23.5
  Top 1.524: 158.75,23.5 173.36,8.89 183.52,8.89 187.96,4.45 189.86,4.45 X3.5
B11  (via drill 0.6)
  Top 0.61: v129.92,55.24 121.28,55.24 118.74,57.78 JP1.21 JP1.22 | v133.99,55.24 170.18,55.24 171.45,53.97 v171.45,49.53 | RS11.1 v171.45,45.72
  Bottom 0.61: v129.92,55.24 v133.99,55.24 | v171.45,49.53 v171.45,45.72
B11OUT
  Top 1.422: Q11.D 172.72,23.5
  Top 1.524: X3.4 189.28,10.16 189.23,10.16 186.06,13.33 182.88,13.33 172.72,23.5
B12  (via drill 0.6)
  Top 0.61: v129.92,56.52 122.55,56.52 121.28,57.78 JP1.23 JP1.24 | v133.99,56.52 184.15,56.52 185.42,55.24 v185.42,49.53 | RS12.1 v185.42,45.72
  Bottom 0.61: v129.92,56.52 v133.99,56.52 | v185.42,49.53 v185.42,45.72
B12OUT
  Top 1.422: Q12.D 186.69,23.5
  Top 1.524: 186.69,23.5 186.69,17.83 X3.3
B13  (via drill 0.6)
  Top 0.61: JP1.26 JP1.25 123.83,62.23 125.35,63.75 135,63.75 139.7,59.05 212.09,59.05 213.36,57.78 v213.36,49.53 | v213.36,45.72 RS14.1
  Bottom 0.61: v213.36,49.53 v213.36,45.72
B13OUT
  Top 1.422: 200.66,23.5 Q13.D
  Top 1.524: 200.66,23.5 200.66,8.94 X3.2
B14  (via drill 0.6)
  Top 0.61: JP1.27 JP1.28 128.27,62.86 133.35,62.86 138.43,57.78 198.12,57.78 199.39,56.52 v199.39,49.53 | v199.39,45.72 RS13.1
  Bottom 0.61: v199.39,49.53 v199.39,45.72
B14OUT
  Top 1.422: 214.63,23.5 Q14.D
  Top 1.524: 214.63,23.5 214.63,8.89 X3.1
DVFEWV
  Top 0.508: GD1.3 33.66,39.22
  Top 0.61: 33.66,39.22 RS1.2
HAL-  (1 unrouted)
  Top 0.406: U1.3 20.32,15.18 U1.4
  Top 1.422: Q1.D 33.02,23.5
  Top 1.93: 20.96,14.6 20.89,14.6 20.32,15.18 | 17.78,15.18 17.2,14.6
  Top 2.032: 33.02,21.59 33.02,23.5
  Top 2.184: 21.57,13.99 20.96,14.6
  Top 2.54: 33.02,23.5 33.02,22.86 | 30.5,13.97 30.48,13.99
  Top 3.81: 33.02,21.59 33.02,17.14 29.85,13.97 30.5,13.97 | 21.57,13.99 30.48,13.99 35.59,13.99 X2.8 X2.7 X2.6 X2.5 X2.4 X2.3 X2.2 X2.1 X1.8 X1.7 X1.6 X1.5 X1.4 X1.3 X1.2 X1.1
I_PV
  Top 0.813: JP2.6 JP2.5 9.52,50.8 19.68,40.64 19.68,29.85 18.42,28.57 U1.7
N$1
  Top 1.27: GD2.5 49.53,32.07 RG2.2
N$2
  Top 1.27: Q1.G RG1.1
N$3
  Top 1.27: GD1.5 35.56,32.07 RG1.2
N$4
  Top 1.27: RG2.1 Q2.G
N$5
  Top 1.27: GD3.5 63.5,32.07 RG3.2
N$6
  Top 1.27: RG3.1 Q3.G
N$7
  Top 1.27: GD4.5 77.47,32.07 RG4.2
N$8
  Top 1.27: RG4.1 Q4.G
N$9
  Top 1.27: GD5.5 91.44,32.07 RG5.2
N$10
  Top 1.27: RG5.1 Q5.G
N$11
  Top 1.27: GD10.5 161.29,32.07 RG10.2
N$12
  Top 1.27: RG10.1 Q10.G
N$13
  Top 1.27: GD9.5 147.32,32.07 RG9.2
N$14
  Top 1.27: RG9.1 Q9.G
N$15
  Top 1.27: GD8.5 133.35,32.07 RG8.2
N$16
  Top 1.27: RG8.1 Q8.G
N$17
  Top 1.27: GD7.5 119.38,32.07 RG7.2
N$18
  Top 1.27: RG7.1 Q7.G
N$19
  Top 1.27: GD6.5 105.41,32.07 RG6.2
N$20
  Top 1.27: RG6.1 Q6.G
N$24
  Top 1.27: GD11.5 175.26,32.07 RG11.2
N$25
  Top 1.27: RG11.1 Q11.G
N$26
  Top 1.27: GD12.5 189.23,32.07 RG12.2
N$27
  Top 1.27: RG12.1 Q12.G
N$28
  Top 1.27: GD13.5 203.2,32.07 RG13.2
N$29
  Top 1.27: RG13.1 Q13.G
N$30
  Top 1.27: GD14.5 217.17,32.07 RG14.2
N$31
  Top 1.27: RG14.1 Q14.G
N$33
  Top 0.406: 8.25,25.88 R3.1 | 8.41,29.84 D2.C | 9.52,34.92 IC3.3
  Top 0.813: R2.2 8.25,25.88 | R3.1 8.41,29.84 | D3.A D2.C 8.4,33.8 9.52,34.92 C19.1
N$34
  Top 0.61: U1.6 19.68,23.08 C20.1
N$35
  Top 0.61: RS2.2 45.72,40.67 GD2.3
N$45
  Top 0.61: RS8.2 129.54,40.67 GD8.3
N$47
  Top 0.61: RS6.2 101.6,40.67 GD6.3
N$51
  Top 0.61: GD14.3 215.27,39.22 RS14.2
PGND  (1 unrouted)
  Bottom 1.27: 119.38,13.97 120.02,13.97 120.65,14.6
  Bottom 1.422: Q3.S 58.42,21.59 | Q4.S 72.39,21.59 | Q5.S 86.36,21.59 | Q9.S 142.24,21.59 | Q10.S 156.21,21.59 | Q11.S 170.18,21.59 | Q12.S 184.15,21.59 | Q13.S 198.12,21.59 | Q14.S 212.09,21.59 | Q1.S 30.48,21.59 | Q2.S 44.45,21.59 | Q6.S 100.33,21.59 | Q7.S 114.3,21.59 | Q8.S 128.27,21.59
  Bottom 2.184: 15.24,7.03 15.24,6.98 | 50.8,15.24 56.52,15.24
  Bottom 2.54: 58.42,21.59 58.42,20.96 64.77,14.6 | 44.45,21.59 50.8,15.24 | 72.39,21.59 79.38,14.6 | 15.24,7.03 PV.2 | 198.12,21.59 198.12,18.42 194.31,14.6 | 184.15,21.59 184.15,17.14 186.69,14.6 | 170.18,21.59 177.17,14.6 | 156.21,21.59 163.2,14.6 | 142.24,21.59 143.51,20.32 151.77,20.32 157.48,14.6 | 128.27,21.59 128.27,20.96 129.54,19.69 138.43,19.69 143.51,14.6 | 114.3,21.59 121.28,14.6 | 100.33,21.59 100.33,20.96 106.68,14.6 | 86.36,21.59 86.36,20.32 92.08,14.6
  Bottom 3.81: 24.76,7.03 22.86,7.03 30.48,14.64 30.48,21.59 | 24.76,7.03 33.66,7.03 41.23,14.6 64.77,14.6 79.38,14.6 92.08,14.6 106.68,14.6 120.65,14.6 121.28,14.6 143.51,14.6 157.48,14.6 163.2,14.6 177.17,14.6 186.69,14.6 194.31,14.6 205.11,14.6 212.09,21.59 | 15.24,6.98 24.76,6.98 24.76,7.03
PV+
  Top 0.762: U1.2 18.36,15.24 17.14,15.24 U1.1 17.14,14.6 16.19,13.65
  Top 0.813: R2.1 8.25,14.6 5.71,12.06 6.31,12.06 PV.1
  Top 2.54: PV.1 14.57,12.03
  Top 3.81: 14.57,12.03 16.19,13.65 16.51,13.97
V_PV
  Top 0.813: JP2.4 JP2.3 6.98,42.54 8.68,40.85 C23.1 8.89,39.16 8.89,38.1 9.52,37.46 IC3.1 IC3.2

### Text on the board
Top: R. Kaminski J. Muskala PVtester - power board 1.0
tNames: + | -